# EAGLE board keyboard_schematic (EAGLE 9.6.1)
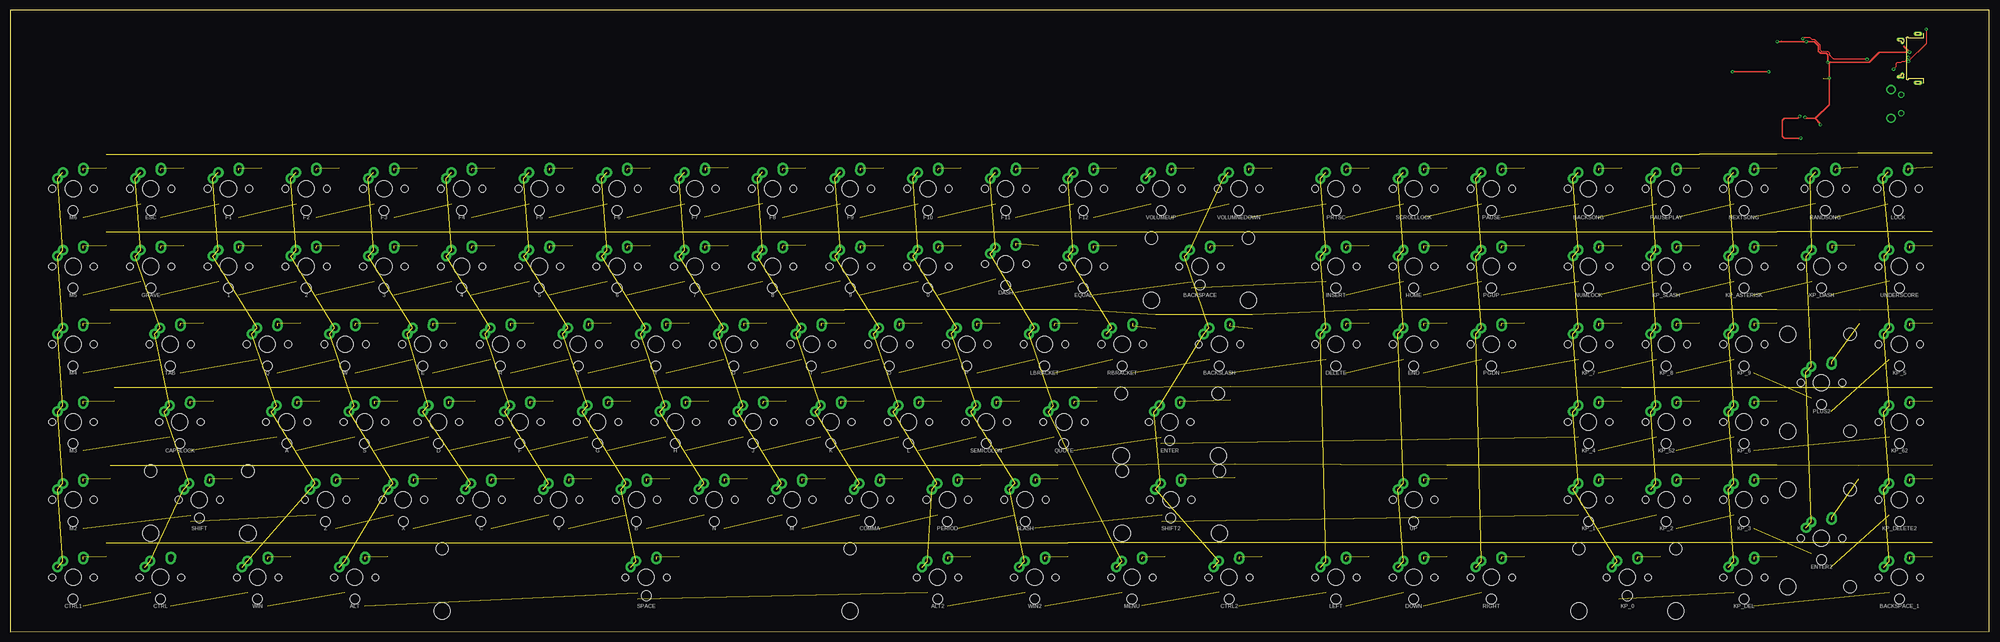
[diagram p6: board, top side]
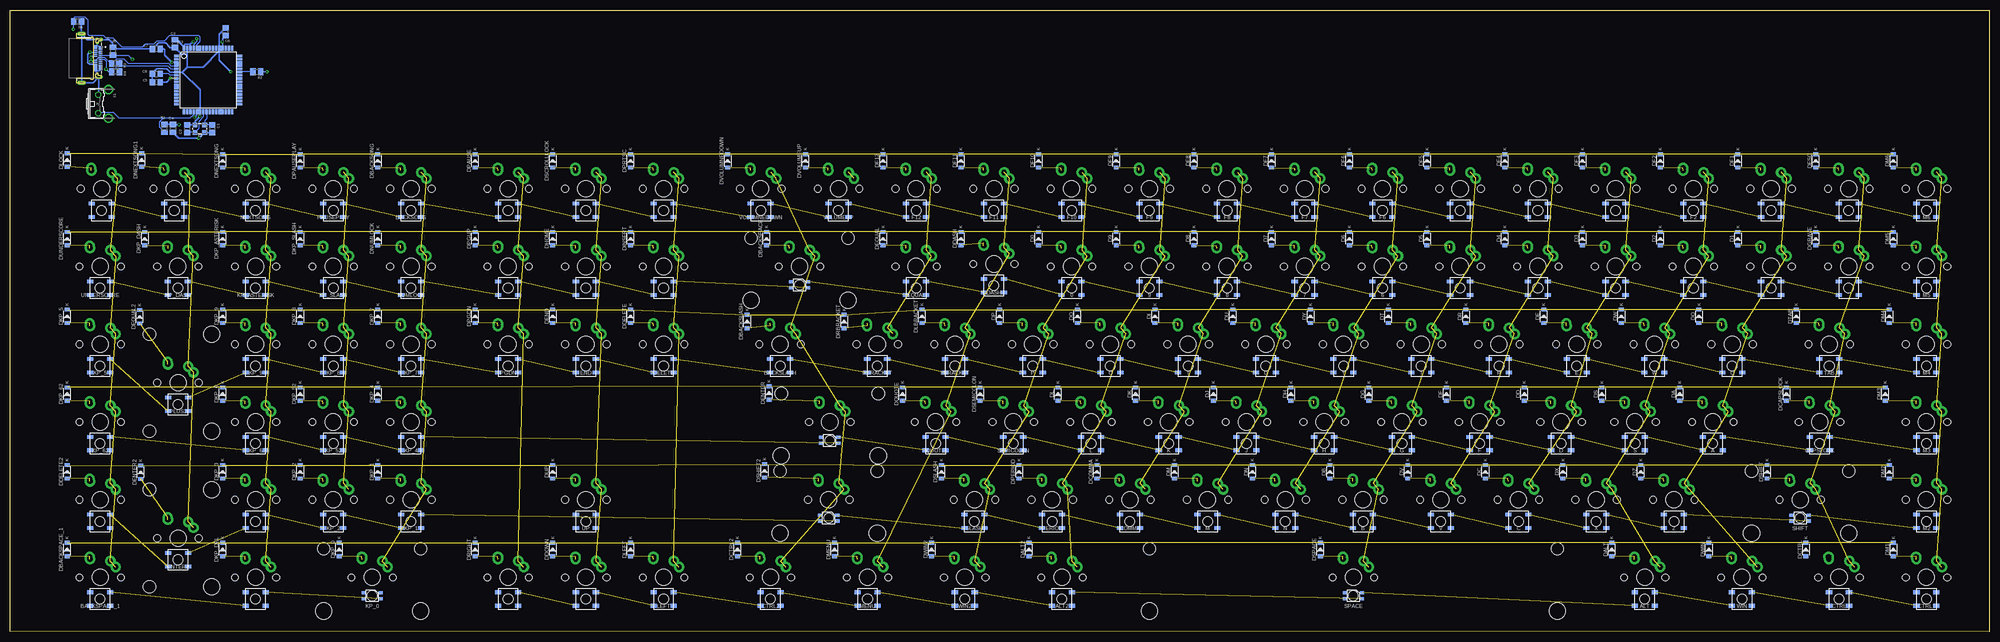
[diagram p7: board, bottom side, seen from below]

Size 485.13 x 152.29 mm. Coordinates in mm from the lower left corner, seen from the top.
Outline: 0.05,0 485.13,0.06 485.08,152.29 0,152.23 0.05,0
Copper layers (1*16): Top 0.035mm / dielectric 1.5mm / Bottom 0.035mm
Design rules "default *": minimum track width 6mil, minimum drill 0.35mm, track to track 6mil, track to pad 6mil, pad to pad 6mil, via to via 6mil, smd to smd 6mil, copper to edge 40mil, drill to drill 6mil, minimum pad ring 10mil, minimum via ring 8mil, stop-mask expansion 4mil, vias tented up to drill 0mil, thermal gap 10mil

## Footprints (pad centres in the part's own frame; a part is rotated, then mirrored left to right if it is on the bottom)
ALPSMX-1U-SMDRGB = drill 1.3 pad 2.54: ALPS1 -2.5,4; ALPS2 2.5,4.5; MX1 -3.81,2.54; MX2 2.54,5.08 | smd 1.5 x 0.9 bottom: DIN -2.45,-3.65; DOUT 2.45,-6.95; VDD 2.45,-3.65; VSS -2.45,-6.95 | hole 4: 0,0 | hole 1.7: -5.08,0; 5.08,0 | hole 2.4: 0,-5.3
ALPSMX-2U-SMDRGB = drill 1.3 pad 2.54: ALPS1 -2.5,4; ALPS2 2.5,4.5; MX1 -3.81,2.54; MX2 2.54,5.08 | smd 1 x 0.75 bottom: B- 2.1,-5.225; G- -2.1,-5.225; LED+ 2.1,-3.775; R- -2.1,-3.775 | hole 4: 0,0; -11.9,-8.24; 11.9,-8.24 | hole 1.7: -5.08,0; 5.08,0 | hole 2.4: 0,-4.5 | hole 3.05: -11.9,7; 11.9,7
C0805 = smd 1.3 x 1.5: 1 -0.95,0; 2 0.95,0
SOD-123 = smd 0.91 x 1.22: A -1.635,0; C 1.635,0
ALPSMX-2U-SMDRGB-ROTATED = drill 1.3 pad 2.54: ALPS1 -2.5,4; ALPS2 2.5,4.5; MX1 -3.81,2.54; MX2 2.54,5.08 | smd 1.5 x 0.9 bottom: DIN -2.45,-3.65; DOUT 2.45,-6.95; VDD 2.45,-3.65; VSS -2.45,-6.95 | hole 4: 0,0; -8.24,-11.9; -8.24,11.9 | hole 1.7: -5.08,0; 5.08,0 | hole 3.05: 7,-11.9; 7,11.9 | hole 2.4: 0,-5.3
TQFP64 = smd 1.194 x 0.559: 1 -7.76,5.905; 2 -7.76,5.118; 3 -7.76,4.331; 4 -7.76,3.543; 5 -7.76,2.756; 6 -7.76,1.968; 7 -7.76,1.181; 8 -7.76,0.394; 9 -7.76,-0.394; 10 -7.76,-1.181; 11 -7.76,-1.968; 12 -7.76,-2.756; 13 -7.76,-3.543; 14 -7.76,-4.331; 15 -7.76,-5.118; 16 -7.76,-5.905; 33 7.76,-5.905; 34 7.76,-5.118; 35 7.76,-4.331; 36 7.76,-3.543; 37 7.76,-2.756; 38 7.76,-1.968; 39 7.76,-1.181; 40 7.76,-0.394; 41 7.76,0.394; 42 7.76,1.181; 43 7.76,1.968; 44 7.76,2.756; 45 7.76,3.543; 46 7.76,4.331; 47 7.76,5.118; 48 7.76,5.905 | smd 0.559 x 1.194: 17 -5.905,-7.76; 18 -5.118,-7.76; 19 -4.331,-7.76; 20 -3.543,-7.76; 21 -2.756,-7.76; 22 -1.968,-7.76; 23 -1.181,-7.76; 24 -0.394,-7.76; 25 0.394,-7.76; 26 1.181,-7.76; 27 1.968,-7.76; 28 2.756,-7.76; 29 3.543,-7.76; 30 4.331,-7.76; 31 5.118,-7.76; 32 5.905,-7.76; 49 5.905,7.76; 50 5.118,7.76; 51 4.331,7.76; 52 3.543,7.76; 53 2.756,7.76; 54 1.968,7.76; 55 1.181,7.76; 56 0.394,7.76; 57 -0.394,7.76; 58 -1.181,7.76; 59 -1.968,7.76; 60 -2.756,7.76; 61 -3.543,7.76; 62 -4.331,7.76; 63 -5.118,7.76; 64 -5.905,7.76
TE_1-2295018-2 = smd 0.3 x 0.8: A1 -2.75,4.63; A2 -2.25,4.63; A3 -1.75,4.63; A4 -1.25,4.63; A5 -0.75,4.63; A6 -0.25,4.63; A7 0.25,4.63; A8 0.75,4.63; A9 1.25,4.63; A10 1.75,4.63; A11 2.25,4.63; A12 2.75,4.63; B1 3,3.43; B2 2.5,3.43; B3 2,3.43; B4 1.5,3.43; B5 1,3.43; B6 0.5,3.43; B7 -0.5,3.43; B8 -1,3.43; B9 -1.5,3.43; B10 -2,3.43; B11 -2.5,3.43; B12 -3,3.43 | drill 0.5 long: P1_1 -4.55,4.22; P2_1 4.55,4.22 | drill 0.35 long: P1_2 -4.191,3.795; P2_2 4.191,3.795 | drill 0.5 pad 1.1 long: P4 -5.97,0; P5 5.97,0
M0805 = smd 1.3 x 1.6: 1 -0.95,0; 2 0.95,0
B3F-31XX = drill 1.016 octagon: 1 -2.261,-1.245; 2 2.261,-1.245 | drill 1.499 pad 2.159: 3 -3.505,1.245; 4 3.505,1.245
ALPSMX-6.25U-SMDRGB = drill 1.3 pad 2.54: ALPS1 -2.5,4; ALPS2 2.5,4.5; MX1 -3.81,2.54; MX2 2.54,5.08 | smd 1 x 0.75 bottom: B- 2.1,-5.225; G- -2.1,-5.225; LED+ 2.1,-3.775; R- -2.1,-3.775 | hole 4: 0,0; -50,-8.24; 50,-8.24 | hole 1.7: -5.08,0; 5.08,0 | hole 2.4: 0,-4.5 | hole 3.05: -50,7; 50,7
CRYSTAL-SMD-3.2X2.5MM = smd 1.2 x 1.1: 1 -1.175,-0.875; 2 1.175,-0.875; 3 1.175,0.875; 4 -1.175,0.875

## Placement (x,y rotation side)
0  KEYSWITCH-RGBSMDLED-ALPSMX-1U-SMDRGB  [ALPSMX-1U-SMDRGB]  224.95,89.49 0 top
1  KEYSWITCH-RGBSMDLED-ALPSMX-1U-SMDRGB  [ALPSMX-1U-SMDRGB]  53.5,89.49 0 top
2  KEYSWITCH-RGBSMDLED-ALPSMX-1U-SMDRGB  [ALPSMX-1U-SMDRGB]  72.55,89.49 0 top
3  KEYSWITCH-RGBSMDLED-ALPSMX-1U-SMDRGB  [ALPSMX-1U-SMDRGB]  91.6,89.49 0 top
4  KEYSWITCH-RGBSMDLED-ALPSMX-1U-SMDRGB  [ALPSMX-1U-SMDRGB]  110.65,89.49 0 top
5  KEYSWITCH-RGBSMDLED-ALPSMX-1U-SMDRGB  [ALPSMX-1U-SMDRGB]  129.7,89.49 0 top
6  KEYSWITCH-RGBSMDLED-ALPSMX-1U-SMDRGB  [ALPSMX-1U-SMDRGB]  148.75,89.49 0 top
7  KEYSWITCH-RGBSMDLED-ALPSMX-1U-SMDRGB  [ALPSMX-1U-SMDRGB]  167.8,89.49 0 top
8  KEYSWITCH-RGBSMDLED-ALPSMX-1U-SMDRGB  [ALPSMX-1U-SMDRGB]  186.85,89.49 0 top
9  KEYSWITCH-RGBSMDLED-ALPSMX-1U-SMDRGB  [ALPSMX-1U-SMDRGB]  205.9,89.49 0 top
A  KEYSWITCH-RGBSMDLED-ALPSMX-1U-SMDRGB  [ALPSMX-1U-SMDRGB]  67.79,51.39 0 top
ALT  KEYSWITCH-RGBSMDLED-ALPSMX-1U-SMDRGB  [ALPSMX-1U-SMDRGB]  84.46,13.29 0 top
ALT2  KEYSWITCH-RGBSMDLED-ALPSMX-1U-SMDRGB  [ALPSMX-1U-SMDRGB]  227.33,13.29 0 top
B  KEYSWITCH-RGBSMDLED-ALPSMX-1U-SMDRGB  [ALPSMX-1U-SMDRGB]  153.51,32.34 0 top
BACKSLASH  KEYSWITCH-RGBSMDLED-ALPSMX-1U-SMDRGB  [ALPSMX-1U-SMDRGB]  296.39,70.44 0 top
BACKSONG  KEYSWITCH-RGBSMDLED-ALPSMX-1U-SMDRGB  [ALPSMX-1U-SMDRGB]  386.88,108.54 0 top
BACKSPACE  KEYSWITCH-RGBSMDLED-ALPSMX-2U-SMDRGB  [ALPSMX-2U-SMDRGB]  291.63,89.49 0 top
BACKSPACE_1  KEYSWITCH-RGBSMDLED-ALPSMX-1U-SMDRGB  [ALPSMX-1U-SMDRGB]  463.08,13.29 0 top
C  KEYSWITCH-RGBSMDLED-ALPSMX-1U-SMDRGB  [ALPSMX-1U-SMDRGB]  115.41,32.34 0 top
C1  22pF  [C0805]  435.6,123.24 270 bottom
C2  22pF  [C0805]  441.7,123.24 90 bottom
C3  0.1uF  [C0805]  444.75,144.09 270 bottom
C4  0.1uF  [C0805]  445.23,123.34 270 bottom
C5  0.1uF  [C0805]  449.32,134.64 180 bottom
C6  0.1uF  [C0805]  432.33,147.01 90 bottom
C7  0.1uF  [C0805]  449.32,142.8 180 bottom
C8  1u  [C0805]  449.32,136.7 0 bottom
CAPSLOCK  KEYSWITCH-RGBSMDLED-ALPSMX-1U-SMDRGB  [ALPSMX-1U-SMDRGB]  41.59,51.39 0 top
COMMA  KEYSWITCH-RGBSMDLED-ALPSMX-1U-SMDRGB  [ALPSMX-1U-SMDRGB]  210.66,32.34 0 top
CTRL  KEYSWITCH-RGBSMDLED-ALPSMX-1U-SMDRGB  [ALPSMX-1U-SMDRGB]  36.83,13.29 0 top
CTRL1  KEYSWITCH-RGBSMDLED-ALPSMX-1U-SMDRGB  [ALPSMX-1U-SMDRGB]  15.4,13.29 0 top
CTRL2  KEYSWITCH-RGBSMDLED-ALPSMX-1U-SMDRGB  [ALPSMX-1U-SMDRGB]  298.77,13.29 0 top
D  KEYSWITCH-RGBSMDLED-ALPSMX-1U-SMDRGB  [ALPSMX-1U-SMDRGB]  104.97,51.39 0 top
D0  [SOD-123]  233.06,96.33 90 bottom
D1  [SOD-123]  61.61,96.33 90 bottom
D2  [SOD-123]  80.66,96.33 90 bottom
D3  [SOD-123]  99.71,96.33 90 bottom
D4  [SOD-123]  118.76,96.33 90 bottom
D5  [SOD-123]  137.81,96.33 90 bottom
D6  [SOD-123]  156.86,96.33 90 bottom
D7  [SOD-123]  175.91,96.33 90 bottom
D8  [SOD-123]  194.96,96.33 90 bottom
D9  [SOD-123]  214.01,96.33 90 bottom
DA  [SOD-123]  75.9,58.23 90 bottom
DALT  [SOD-123]  92.57,20.13 90 bottom
DALT2  [SOD-123]  235.44,20.13 90 bottom
DASH  KEYSWITCH-RGBSMDLED-ALPSMX-1U-SMDRGB  [ALPSMX-1U-SMDRGB]  244,90.09 0 top
DB  [SOD-123]  161.62,39.18 90 bottom
DBACKSLASH  [SOD-123]  304.5,76.01 90 bottom
DBACKSONG  [SOD-123]  394.99,115.38 90 bottom
DBACKSPACE  [SOD-123]  299.74,96.33 90 bottom
DBACKSPACE_1  [SOD-123]  471.19,20.13 90 bottom
DC  [SOD-123]  123.52,39.18 90 bottom
DCAPSLOCK  [SOD-123]  49.7,58.23 90 bottom
DCOMMA  [SOD-123]  218.77,39.18 90 bottom
DCTRL  [SOD-123]  44.94,20.13 90 bottom
DCTRL2  [SOD-123]  306.88,20.13 90 bottom
DD  [SOD-123]  114,58.23 90 bottom
DDASH  [SOD-123]  252.11,96.33 90 bottom
DDELETE  [SOD-123]  333.07,77.28 90 bottom
DDELETE2  [SOD-123]  471.19,39.18 90 bottom
DDOWN  [SOD-123]  352.12,20.13 90 bottom
DE  [SOD-123]  109.24,77.28 90 bottom
DELETE  KEYSWITCH-RGBSMDLED-ALPSMX-1U-SMDRGB  [ALPSMX-1U-SMDRGB]  324.96,70.44 0 top
DEND  [SOD-123]  352.12,77.28 90 bottom
DENTER  [SOD-123]  299.13,58.48 90 bottom
DENTER2  [SOD-123]  453.16,39.06 90 bottom
DEQUAL  [SOD-123]  271.16,96.33 90 bottom
DEQUAL2  [SOD-123]  453.41,77.16 90 bottom
DESC  [SOD-123]  42.56,115.38 90 bottom
DF  [SOD-123]  133.05,58.23 90 bottom
DF1  [SOD-123]  61.61,115.38 90 bottom
DF2  [SOD-123]  80.66,115.38 90 bottom
DF3  [SOD-123]  99.71,115.38 90 bottom
DF4  [SOD-123]  118.76,115.38 90 bottom
DF5  [SOD-123]  137.81,115.38 90 bottom
DF6  [SOD-123]  156.86,115.38 90 bottom
DF7  [SOD-123]  175.91,115.38 90 bottom
DF8  [SOD-123]  194.96,115.38 90 bottom
DF9  [SOD-123]  214.01,115.38 90 bottom
DF10  [SOD-123]  233.06,115.38 90 bottom
DF11  [SOD-123]  252.11,115.38 90 bottom
DF12  [SOD-123]  271.16,115.38 90 bottom
DG  [SOD-123]  152.1,58.23 90 bottom
DGRAVE  [SOD-123]  42.56,96.33 90 bottom
DH  [SOD-123]  171.15,58.23 90 bottom
DHOME  [SOD-123]  352.12,96.33 90 bottom
DI  [SOD-123]  204.49,77.28 90 bottom
DINSERT  [SOD-123]  333.07,96.33 90 bottom
DJ  [SOD-123]  190.2,58.23 90 bottom
DK  [SOD-123]  209.25,58.23 90 bottom
DKP_0  [SOD-123]  404.51,20.13 90 bottom
DKP_1  [SOD-123]  394.99,39.18 90 bottom
DKP_2  [SOD-123]  414.04,39.18 90 bottom
DKP_3  [SOD-123]  433.09,39.18 90 bottom
DKP_4  [SOD-123]  394.99,58.23 90 bottom
DKP_5  [SOD-123]  471.19,77.28 90 bottom
DKP_6  [SOD-123]  433.09,58.23 90 bottom
DKP_7  [SOD-123]  394.99,77.28 90 bottom
DKP_8  [SOD-123]  414.04,77.28 90 bottom
DKP_9  [SOD-123]  433.09,77.28 90 bottom
DKP_52  [SOD-123]  414.04,58.23 90 bottom
DKP_62  [SOD-123]  471.19,58.23 90 bottom
DKP_ASTERISK  [SOD-123]  433.09,96.33 90 bottom
DKP_DASH  [SOD-123]  452.14,96.33 90 bottom
DKP_DEL  [SOD-123]  433.09,20.13 90 bottom
DKP_SLASH  [SOD-123]  414.04,96.33 90 bottom
DL  [SOD-123]  228.3,58.23 90 bottom
DLBRACKET  [SOD-123]  261.64,77.28 90 bottom
DLEFT  [SOD-123]  333.07,20.13 90 bottom
DLOCK  [SOD-123]  471.19,115.59 90 bottom
DM  [SOD-123]  199.72,39.18 90 bottom
DM1  [SOD-123]  23.51,20.13 90 bottom
DM2  [SOD-123]  24.51,39.18 90 bottom
DM3  [SOD-123]  25.51,58.23 90 bottom
DM4  [SOD-123]  24.51,77.28 90 bottom
DM5  [SOD-123]  23.51,96.33 90 bottom
DM6  [SOD-123]  23.51,115.38 90 bottom
DMENU  [SOD-123]  283.07,20.13 90 bottom
DN  [SOD-123]  180.67,39.18 90 bottom
DNEXTSONG  [SOD-123]  433.09,115.38 90 bottom
DNEXTSONG1  [SOD-123]  452.93,115.59 90 bottom
DNUMLOCK  [SOD-123]  394.99,96.33 90 bottom
DO  [SOD-123]  223.54,77.28 90 bottom
DOWN  KEYSWITCH-RGBSMDLED-ALPSMX-1U-SMDRGB  [ALPSMX-1U-SMDRGB]  344.01,13.29 0 top
DP  [SOD-123]  242.59,77.28 90 bottom
DPAUSE  [SOD-123]  371.17,115.38 90 bottom
DPAUSEPLAY  [SOD-123]  414.04,115.38 90 bottom
DPERIOD  [SOD-123]  237.82,39.18 90 bottom
DPGDN  [SOD-123]  371.17,77.28 90 bottom
DPGUP  [SOD-123]  371.17,96.33 90 bottom
DPRTSC  [SOD-123]  333.07,115.38 90 bottom
DQ  [SOD-123]  71.14,77.28 90 bottom
DQUOTE  [SOD-123]  266.4,58.23 90 bottom
DR  [SOD-123]  128.29,77.28 90 bottom
DRBRACKET  [SOD-123]  280.69,76.01 90 bottom
DRIGHT  [SOD-123]  371.17,20.13 90 bottom
DS  [SOD-123]  94.95,58.23 90 bottom
DSCROLLLOCK  [SOD-123]  352.12,115.38 90 bottom
DSEMICOLON  [SOD-123]  247.35,58.23 90 bottom
DSHIFT  [SOD-123]  54.47,39.18 90 bottom
DSHIFT2  [SOD-123]  300.21,39.43 90 bottom
DSLASH  [SOD-123]  256.87,39.18 90 bottom
DSPACE  [SOD-123]  164,20.13 90 bottom
DT  [SOD-123]  147.34,77.28 90 bottom
DTAB  [SOD-123]  47.32,77.28 90 bottom
DU  [SOD-123]  185.44,77.28 90 bottom
DUNDERSCORE  [SOD-123]  471.19,96.33 90 bottom
DUP  [SOD-123]  352.12,39.18 90 bottom
DV  [SOD-123]  142.57,39.18 90 bottom
DVOLUMEUP  [SOD-123]  290.21,115.38 90 bottom
DVOLUMNEDOWN  [SOD-123]  309.26,115.38 90 bottom
DW  [SOD-123]  90.19,77.28 90 bottom
DWIN  [SOD-123]  68.75,20.13 90 bottom
DWIN2  [SOD-123]  259.25,20.13 90 bottom
DX  [SOD-123]  104.47,39.18 90 bottom
DY  [SOD-123]  166.39,77.28 90 bottom
DZ  [SOD-123]  85.42,39.18 90 bottom
E  KEYSWITCH-RGBSMDLED-ALPSMX-1U-SMDRGB  [ALPSMX-1U-SMDRGB]  101.13,70.44 0 top
END  KEYSWITCH-RGBSMDLED-ALPSMX-1U-SMDRGB  [ALPSMX-1U-SMDRGB]  344.01,70.44 0 top
ENTER  KEYSWITCH-RGBSMDLED-ALPSMX-2U-SMDRGB  [ALPSMX-2U-SMDRGB]  284.23,51.39 0 top
ENTER2  KEYSWITCH-RGBSMDLED-ALPSMX-2U-SMDRGB-ROTATED  [ALPSMX-2U-SMDRGB-ROTATED]  443.99,22.91 0 top
EQUAL  KEYSWITCH-RGBSMDLED-ALPSMX-1U-SMDRGB  [ALPSMX-1U-SMDRGB]  263.05,89.49 0 top
ESC  KEYSWITCH-RGBSMDLED-ALPSMX-1U-SMDRGB  [ALPSMX-1U-SMDRGB]  34.45,108.54 0 top
F  KEYSWITCH-RGBSMDLED-ALPSMX-1U-SMDRGB  [ALPSMX-1U-SMDRGB]  124.94,51.39 0 top
F1  KEYSWITCH-RGBSMDLED-ALPSMX-1U-SMDRGB  [ALPSMX-1U-SMDRGB]  53.5,108.54 0 top
F2  KEYSWITCH-RGBSMDLED-ALPSMX-1U-SMDRGB  [ALPSMX-1U-SMDRGB]  72.55,108.54 0 top
F3  KEYSWITCH-RGBSMDLED-ALPSMX-1U-SMDRGB  [ALPSMX-1U-SMDRGB]  91.6,108.54 0 top
F4  KEYSWITCH-RGBSMDLED-ALPSMX-1U-SMDRGB  [ALPSMX-1U-SMDRGB]  110.65,108.54 0 top
F5  KEYSWITCH-RGBSMDLED-ALPSMX-1U-SMDRGB  [ALPSMX-1U-SMDRGB]  129.7,108.54 0 top
F6  KEYSWITCH-RGBSMDLED-ALPSMX-1U-SMDRGB  [ALPSMX-1U-SMDRGB]  148.75,108.54 0 top
F7  KEYSWITCH-RGBSMDLED-ALPSMX-1U-SMDRGB  [ALPSMX-1U-SMDRGB]  167.8,108.54 0 top
F8  KEYSWITCH-RGBSMDLED-ALPSMX-1U-SMDRGB  [ALPSMX-1U-SMDRGB]  186.85,108.54 0 top
F9  KEYSWITCH-RGBSMDLED-ALPSMX-1U-SMDRGB  [ALPSMX-1U-SMDRGB]  205.9,108.54 0 top
F10  KEYSWITCH-RGBSMDLED-ALPSMX-1U-SMDRGB  [ALPSMX-1U-SMDRGB]  224.95,108.54 0 top
F11  KEYSWITCH-RGBSMDLED-ALPSMX-1U-SMDRGB  [ALPSMX-1U-SMDRGB]  244,108.54 0 top
F12  KEYSWITCH-RGBSMDLED-ALPSMX-1U-SMDRGB  [ALPSMX-1U-SMDRGB]  263.05,108.54 0 top
G  KEYSWITCH-RGBSMDLED-ALPSMX-1U-SMDRGB  [ALPSMX-1U-SMDRGB]  143.99,51.39 0 top
GRAVE  KEYSWITCH-RGBSMDLED-ALPSMX-1U-SMDRGB  [ALPSMX-1U-SMDRGB]  34.45,89.49 0 top
H  KEYSWITCH-RGBSMDLED-ALPSMX-1U-SMDRGB  [ALPSMX-1U-SMDRGB]  163.04,51.39 0 top
HOME  KEYSWITCH-RGBSMDLED-ALPSMX-1U-SMDRGB  [ALPSMX-1U-SMDRGB]  344.01,89.49 0 top
I  KEYSWITCH-RGBSMDLED-ALPSMX-1U-SMDRGB  [ALPSMX-1U-SMDRGB]  196.38,70.44 0 top
IC3  [TQFP64]  436.62,135.18 0 bottom
INSERT  KEYSWITCH-RGBSMDLED-ALPSMX-1U-SMDRGB  [ALPSMX-1U-SMDRGB]  324.96,89.49 0 top
J  KEYSWITCH-RGBSMDLED-ALPSMX-1U-SMDRGB  [ALPSMX-1U-SMDRGB]  182.09,51.39 0 top
J1  1-2295018-2  [TE_1-2295018-2]  467.61,140.51 270 bottom
K  KEYSWITCH-RGBSMDLED-ALPSMX-1U-SMDRGB  [ALPSMX-1U-SMDRGB]  201.14,51.39 0 top
KP_0  KEYSWITCH-RGBSMDLED-ALPSMX-2U-SMDRGB  [ALPSMX-2U-SMDRGB]  396.4,13.29 0 top
KP_1  KEYSWITCH-RGBSMDLED-ALPSMX-1U-SMDRGB  [ALPSMX-1U-SMDRGB]  386.88,32.34 0 top
KP_2  KEYSWITCH-RGBSMDLED-ALPSMX-1U-SMDRGB  [ALPSMX-1U-SMDRGB]  405.93,32.34 0 top
KP_3  KEYSWITCH-RGBSMDLED-ALPSMX-1U-SMDRGB  [ALPSMX-1U-SMDRGB]  424.98,32.34 0 top
KP_4  KEYSWITCH-RGBSMDLED-ALPSMX-1U-SMDRGB  [ALPSMX-1U-SMDRGB]  386.88,51.39 0 top
KP_5  KEYSWITCH-RGBSMDLED-ALPSMX-1U-SMDRGB  [ALPSMX-1U-SMDRGB]  463.08,70.44 0 top
KP_6  KEYSWITCH-RGBSMDLED-ALPSMX-1U-SMDRGB  [ALPSMX-1U-SMDRGB]  424.98,51.39 0 top
KP_7  KEYSWITCH-RGBSMDLED-ALPSMX-1U-SMDRGB  [ALPSMX-1U-SMDRGB]  386.88,70.44 0 top
KP_8  KEYSWITCH-RGBSMDLED-ALPSMX-1U-SMDRGB  [ALPSMX-1U-SMDRGB]  405.93,70.44 0 top
KP_9  KEYSWITCH-RGBSMDLED-ALPSMX-1U-SMDRGB  [ALPSMX-1U-SMDRGB]  424.98,70.44 0 top
KP_52  KEYSWITCH-RGBSMDLED-ALPSMX-1U-SMDRGB  [ALPSMX-1U-SMDRGB]  405.93,51.39 0 top
KP_62  KEYSWITCH-RGBSMDLED-ALPSMX-1U-SMDRGB  [ALPSMX-1U-SMDRGB]  463.08,51.39 0 top
KP_ASTERISK  KEYSWITCH-RGBSMDLED-ALPSMX-1U-SMDRGB  [ALPSMX-1U-SMDRGB]  424.98,89.49 0 top
KP_DASH  KEYSWITCH-RGBSMDLED-ALPSMX-1U-SMDRGB  [ALPSMX-1U-SMDRGB]  444.03,89.49 0 top
KP_DEL  KEYSWITCH-RGBSMDLED-ALPSMX-1U-SMDRGB  [ALPSMX-1U-SMDRGB]  424.98,13.29 0 top
KP_DELETE2  KEYSWITCH-RGBSMDLED-ALPSMX-1U-SMDRGB  [ALPSMX-1U-SMDRGB]  463.08,32.34 0 top
KP_SLASH  KEYSWITCH-RGBSMDLED-ALPSMX-1U-SMDRGB  [ALPSMX-1U-SMDRGB]  405.93,89.49 0 top
L  KEYSWITCH-RGBSMDLED-ALPSMX-1U-SMDRGB  [ALPSMX-1U-SMDRGB]  220.19,51.39 0 top
LBRACKET  KEYSWITCH-RGBSMDLED-ALPSMX-1U-SMDRGB  [ALPSMX-1U-SMDRGB]  253.53,70.44 0 top
LEFT  KEYSWITCH-RGBSMDLED-ALPSMX-1U-SMDRGB  [ALPSMX-1U-SMDRGB]  324.96,13.29 0 top
LOCK  KEYSWITCH-RGBSMDLED-ALPSMX-1U-SMDRGB  [ALPSMX-1U-SMDRGB]  462.73,108.54 0 top
M  KEYSWITCH-RGBSMDLED-ALPSMX-1U-SMDRGB  [ALPSMX-1U-SMDRGB]  191.61,32.34 0 top
M2  KEYSWITCH-RGBSMDLED-ALPSMX-1U-SMDRGB  [ALPSMX-1U-SMDRGB]  15.4,32.34 0 top
M3  KEYSWITCH-RGBSMDLED-ALPSMX-1U-SMDRGB  [ALPSMX-1U-SMDRGB]  15.4,51.39 0 top
M4  KEYSWITCH-RGBSMDLED-ALPSMX-1U-SMDRGB  [ALPSMX-1U-SMDRGB]  15.4,70.44 0 top
M5  KEYSWITCH-RGBSMDLED-ALPSMX-1U-SMDRGB  [ALPSMX-1U-SMDRGB]  15.4,89.49 0 top
M6  KEYSWITCH-RGBSMDLED-ALPSMX-1U-SMDRGB  [ALPSMX-1U-SMDRGB]  15.4,108.54 0 top
MENU  KEYSWITCH-RGBSMDLED-ALPSMX-1U-SMDRGB  [ALPSMX-1U-SMDRGB]  274.96,13.29 0 top
N  KEYSWITCH-RGBSMDLED-ALPSMX-1U-SMDRGB  [ALPSMX-1U-SMDRGB]  172.56,32.34 0 top
NEXTSONG  KEYSWITCH-RGBSMDLED-ALPSMX-1U-SMDRGB  [ALPSMX-1U-SMDRGB]  424.98,108.54 0 top
NUMLOCK  KEYSWITCH-RGBSMDLED-ALPSMX-1U-SMDRGB  [ALPSMX-1U-SMDRGB]  386.88,89.49 0 top
O  KEYSWITCH-RGBSMDLED-ALPSMX-1U-SMDRGB  [ALPSMX-1U-SMDRGB]  215.43,70.44 0 top
P  KEYSWITCH-RGBSMDLED-ALPSMX-1U-SMDRGB  [ALPSMX-1U-SMDRGB]  234.48,70.44 0 top
PAUSE  KEYSWITCH-RGBSMDLED-ALPSMX-1U-SMDRGB  [ALPSMX-1U-SMDRGB]  363.06,108.54 0 top
PAUSEPLAY  KEYSWITCH-RGBSMDLED-ALPSMX-1U-SMDRGB  [ALPSMX-1U-SMDRGB]  405.93,108.54 0 top
PERIOD  KEYSWITCH-RGBSMDLED-ALPSMX-1U-SMDRGB  [ALPSMX-1U-SMDRGB]  229.71,32.34 0 top
PGDN  KEYSWITCH-RGBSMDLED-ALPSMX-1U-SMDRGB  [ALPSMX-1U-SMDRGB]  363.06,70.44 0 top
PGUP  KEYSWITCH-RGBSMDLED-ALPSMX-1U-SMDRGB  [ALPSMX-1U-SMDRGB]  363.06,89.49 0 top
PLUS2  KEYSWITCH-RGBSMDLED-ALPSMX-2U-SMDRGB-ROTATED  [ALPSMX-2U-SMDRGB-ROTATED]  443.99,61.01 0 top
PRTSC  KEYSWITCH-RGBSMDLED-ALPSMX-1U-SMDRGB  [ALPSMX-1U-SMDRGB]  324.96,108.54 0 top
Q  KEYSWITCH-RGBSMDLED-ALPSMX-1U-SMDRGB  [ALPSMX-1U-SMDRGB]  63.03,70.44 0 top
QUOTE  KEYSWITCH-RGBSMDLED-ALPSMX-1U-SMDRGB  [ALPSMX-1U-SMDRGB]  258.29,51.39 0 top
R  KEYSWITCH-RGBSMDLED-ALPSMX-1U-SMDRGB  [ALPSMX-1U-SMDRGB]  120.18,70.44 0 top
R1  10k  [M0805]  447.26,123.34 270 bottom
R2  10k  [M0805]  424.68,137.21 180 bottom
R3  22  [M0805]  459.28,139.24 0 bottom
R4  22  [M0805]  459.28,137.21 0 bottom
R5  5.1k  [M0805]  459.96,142.26 90 bottom
R6  5.1k  [M0805]  468.62,149.55 180 bottom
RANDSONG  KEYSWITCH-RGBSMDLED-ALPSMX-1U-SMDRGB  [ALPSMX-1U-SMDRGB]  444.93,108.54 0 top
RBRACKET  KEYSWITCH-RGBSMDLED-ALPSMX-1U-SMDRGB  [ALPSMX-1U-SMDRGB]  272.58,70.44 0 top
RIGHT  KEYSWITCH-RGBSMDLED-ALPSMX-1U-SMDRGB  [ALPSMX-1U-SMDRGB]  363.06,13.29 0 top
S  KEYSWITCH-RGBSMDLED-ALPSMX-1U-SMDRGB  [ALPSMX-1U-SMDRGB]  86.84,51.39 0 top
S1  [B3F-31XX]  462.27,129.34 270 bottom
SCROLLLOCK  KEYSWITCH-RGBSMDLED-ALPSMX-1U-SMDRGB  [ALPSMX-1U-SMDRGB]  344.01,108.54 0 top
SEMICOLON  KEYSWITCH-RGBSMDLED-ALPSMX-1U-SMDRGB  [ALPSMX-1U-SMDRGB]  239.24,51.39 0 top
SHIFT  KEYSWITCH-RGBSMDLED-ALPSMX-2U-SMDRGB  [ALPSMX-2U-SMDRGB]  46.36,32.34 0 top
SHIFT2  KEYSWITCH-RGBSMDLED-ALPSMX-2U-SMDRGB  [ALPSMX-2U-SMDRGB]  284.48,32.34 0 top
SLASH  KEYSWITCH-RGBSMDLED-ALPSMX-1U-SMDRGB  [ALPSMX-1U-SMDRGB]  248.76,32.34 0 top
SPACE  KEYSWITCH-RGBSMDLED-ALPSMX-6.25U-SMDRGB  [ALPSMX-6.25U-SMDRGB]  155.89,13.29 0 top
T  KEYSWITCH-RGBSMDLED-ALPSMX-1U-SMDRGB  [ALPSMX-1U-SMDRGB]  139.23,70.44 0 top
TAB  KEYSWITCH-RGBSMDLED-ALPSMX-1U-SMDRGB  [ALPSMX-1U-SMDRGB]  39.21,70.44 0 top
U  KEYSWITCH-RGBSMDLED-ALPSMX-1U-SMDRGB  [ALPSMX-1U-SMDRGB]  177.33,70.44 0 top
UNDERSCORE  KEYSWITCH-RGBSMDLED-ALPSMX-1U-SMDRGB  [ALPSMX-1U-SMDRGB]  463.08,89.49 0 top
UP  KEYSWITCH-RGBSMDLED-ALPSMX-1U-SMDRGB  [ALPSMX-1U-SMDRGB]  344.01,32.34 0 top
V  KEYSWITCH-RGBSMDLED-ALPSMX-1U-SMDRGB  [ALPSMX-1U-SMDRGB]  134.46,32.34 0 top
VOLUMEUP  KEYSWITCH-RGBSMDLED-ALPSMX-1U-SMDRGB  [ALPSMX-1U-SMDRGB]  282.1,108.54 0 top
VOLUMNEDOWN  KEYSWITCH-RGBSMDLED-ALPSMX-1U-SMDRGB  [ALPSMX-1U-SMDRGB]  301.15,108.54 0 top
W  KEYSWITCH-RGBSMDLED-ALPSMX-1U-SMDRGB  [ALPSMX-1U-SMDRGB]  82.08,70.44 0 top
WIN  KEYSWITCH-RGBSMDLED-ALPSMX-1U-SMDRGB  [ALPSMX-1U-SMDRGB]  60.64,13.29 0 top
WIN2  KEYSWITCH-RGBSMDLED-ALPSMX-1U-SMDRGB  [ALPSMX-1U-SMDRGB]  251.14,13.29 0 top
X  KEYSWITCH-RGBSMDLED-ALPSMX-1U-SMDRGB  [ALPSMX-1U-SMDRGB]  96.36,32.34 0 top
Y  KEYSWITCH-RGBSMDLED-ALPSMX-1U-SMDRGB  [ALPSMX-1U-SMDRGB]  158.28,70.44 0 top
Y2  CRYSTAL-GROUNDEDSMD-3.2X2.5  [CRYSTAL-SMD-3.2X2.5MM]  438.65,123.24 180 bottom
Z  KEYSWITCH-RGBSMDLED-ALPSMX-1U-SMDRGB  [ALPSMX-1U-SMDRGB]  77.31,32.34 0 top

## Tracks (layer width: path | path; a pad name or v marks a point on that pad's centre or on a via)
+5V  (via drill 0.35)  (2 unrouted)
  Top 0.406: 465.55,142.01 v465.58,142.04 | v439.92,126.03 440.18,125.78 442.46,125.78 | v443.73,124.26 443.73,124.51 442.46,125.78 | v433.13,144.6 434.08,144.6 | 434.08,144.6 v440.25,144.6 442.18,144.6 443.22,143.56 443.22,142.29 443.81,141.71 445.13,141.71 445.51,141.33 v445.51,139.5 | v445.51,139.5 445.87,139.14 v445.87,135.58 | v445.87,135.58 445.87,135.53 | v445.87,135.58 445.87,129.18 442.46,125.78 | v465.58,142.04 464.13,143.48 | 434.16,144.68 434.08,144.6 | v445.51,139.5 455.67,139.5 458.21,142.04 v465.58,142.04
  Bottom 0.2: J1.A4 463.08,141.86 463.48,141.86 463.64,142.01 J1.B9
  Bottom 0.305: v465.58,142.04 465.55,142.01 J1.B9 | J1.B4 464.74,139.02
  Bottom 0.406: IC3.52 433.08,144.55 | 433.08,144.55 v433.13,144.6 | v440.25,144.6 440.95,143.9 | 440.95,143.9 IC3.62 | 440.95,143.9 440.96,143.89 442.18,143.89 442.56,143.51 | 442.56,143.51 442.56,142.98 IC3.64 | 442.56,143.51 442.67,143.51 444.2,145.04 C3.1 | IC3.21 439.41,127.38 439.41,126.54 v439.92,126.03 | 444.37,139.5 IC3.3 445.5,139.51 v445.51,139.5 | C7.1 447.54,142.8 447.29,142.54 447.29,141.27 v445.52,139.51 | IC3.8 445.88,135.57 446.81,134.65 C5.1 | v443.73,124.26 445.2,124.26 C4.1 R1.1 | C6.1 433.08,145.31 433.08,144.55 | v465.58,142.04 466.08,141.53 466.08,139.47 465.63,139.02 464.74,139.02 464.73,139.01
CC1  (via drill 0.35)
  Top 0.2: v455.16,140.26 447.03,140.26 446.02,141.27 446.02,141.78 445.64,142.16 444.12,142.16 443.68,142.6 443.68,143.75 442.37,145.06 441.73,145.06 441.19,145.59 439.67,145.59 v439.41,145.34
  Bottom 0.2: J1.A5 459.96,141.26 R5.1 456.22,141.31 v455.16,140.26 | IC3.61 440.16,143.8 439.41,144.55 v439.41,145.34
CC2  (via drill 0.35)
  Top 0.2: v469.64,147.62 469.64,144.07 v465.32,139.75
  Bottom 0.2: J1.B5 465.08,139.51 v465.32,139.75 | v469.64,147.62 469.64,149.49 R6.2 469.57,150.48 469.39,150.67 466.85,150.67 466.08,149.91 466.08,146.35 465.83,146.1 462.27,146.1 461.69,145.52 460.03,145.52 457.82,143.31 452.62,143.31 451.86,144.07 449.83,144.07 449.07,144.83 447.29,144.83 445.97,146.15 438.96,146.15 438.65,145.85 438.65,144.58 439.41,143.81 439.41,142.98 IC3.60
COL1  (11 unrouted)
COL2  (11 unrouted)
COL3  (11 unrouted)
COL4  (11 unrouted)
COL5  (9 unrouted)
COL6  (9 unrouted)
COL7  (11 unrouted)
COL8  (9 unrouted)
COL9  (9 unrouted)
COL10  (9 unrouted)
COL12  (11 unrouted)
COL13  (11 unrouted)
COL14  (9 unrouted)
COL15  (5 unrouted)
COL16  (1 unrouted)
COL17  (11 unrouted)
COL18  (7 unrouted)
COL19  (9 unrouted)
COL20  (7 unrouted)
COL21  (11 unrouted)
COL22  (9 unrouted)
COL23  (11 unrouted)
COL24  (7 unrouted)
COL25  (11 unrouted)
D+32U
  Bottom 0.2: IC3.5 445.73,137.93 446.53,138.73 457.82,138.73 R3.2
D+USB
  Bottom 0.152: J1.A6 463.43,140.76 J1.B6
  Bottom 0.2: J1.A6 462.96,140.74 462.04,140.74 460.54,139.24 R3.1
D-32U4
  Bottom 0.2: IC3.4 445.75,138.72 446.27,139.24 456.18,139.24 457.23,140.29 459.08,140.29 459.23,140.15 459.23,138.11 R4.2
D-USB  (via drill 0.35)
  Top 0.152: v461.64,137.87 462.27,138.5 462.27,139.24 462.53,139.5 463.54,139.5 463.8,139.75 464.56,139.75 464.72,139.91 464.72,140.13 v465.3,140.72
  Bottom 0.152: J1.B7 465,141.01 v465.3,140.72
  Bottom 0.2: J1.A7 462.07,140.27 461.64,139.84 v461.64,137.87 v461.64,137.86 460.99,137.21 R4.1
GND  (via drill 0.35)
  Top 0.406: v431.03,137.21 v422.14,137.21 | v438.65,126.29 438.14,125.78 434.84,125.78 434.33,125.27 434.33,121.46 434.84,120.95 v438.91,120.95
  Bottom 0.152: J1.P1_1 463.45,145.06 J1.P1_2
  Bottom 0.254: 439.69,123.98 439.82,124.11 | J1.A1 463.23,143.51 J1.B12 | J1.B1 463.23,137.51 J1.A12
  Bottom 0.305: R6.1 467.6,149.48 | J1.B12 463.81,143.88 | J1.B1 464.18,136.69
  Bottom 0.406: S1.1 463.39,131.73 J1.P2_1 | 442.93,137.15 IC3.6 445.96,137.15 446.78,137.97 449.25,137.97 450.27,136.96 C8.1 C5.2 | 442.93,137.15 438.59,132.8 IC3.22 438.65,127.36 v438.65,126.29 439.19,125.75 439.19,125.73 439.83,125.09 Y2.2 | IC3.63 441.74,141.53 | 441.74,141.53 441.74,138.34 | 441.74,138.34 442.93,137.15 | IC3.53 433.86,142.35 437.87,138.34 441.74,138.34 | 441.74,141.53 443.13,141.53 C3.2 | 463.81,143.88 J1.P1_2 | J1.P4 466.19,145.06 J1.P1_1 460.88,145.06 459.96,144.14 R5.2 459.55,142.8 C7.2 449.38,143.69 448.75,144.32 447.03,144.32 445.86,143.14 C3.2 | J1.P4 467.58,146.51 | 464.18,136.69 J1.P2_2 463.75,136.32 J1.P2_1 | J1.P2_1 464.81,134.54 J1.P5 J1.P4 | R6.1 467.67,146.55 J1.P4 | C3.2 444.98,142.91 | IC3.53 433.86,140.04 v431.03,137.21 | R2.1 v422.14,137.21 | Y2.2 439.9,124.19 C2.2 | C1.2 437.4,122.29 Y2.4 438.89,120.95 v438.91,120.95 443.79,120.95 C4.2 | C6.2 433.22,147.07 433.23,147.07 433.86,146.43 IC3.53 | Y2.2 439.82,124.11
N$1  (2 unrouted)
N$2  (2 unrouted)
N$3  (2 unrouted)
N$4  (2 unrouted)
N$5  (2 unrouted)
N$6  (2 unrouted)
N$7  (2 unrouted)
N$8  (2 unrouted)
N$9  (2 unrouted)
N$10  (2 unrouted)
N$11  (2 unrouted)
N$12  (2 unrouted)
N$13  (2 unrouted)
N$14  (2 unrouted)
N$15  (2 unrouted)
N$16  (2 unrouted)
N$17  (2 unrouted)
N$18  (2 unrouted)
N$19  (2 unrouted)
N$20  (2 unrouted)
N$21  (2 unrouted)
N$22  (2 unrouted)
N$23  (2 unrouted)
N$24  (2 unrouted)
N$25  (2 unrouted)
N$26  (2 unrouted)
N$27  (2 unrouted)
N$28  (2 unrouted)
N$29  (2 unrouted)
N$30  (2 unrouted)
N$31  (2 unrouted)
N$32  (2 unrouted)
N$33  (2 unrouted)
N$34  (2 unrouted)
N$35  (2 unrouted)
N$36  (2 unrouted)
N$37  (2 unrouted)
N$38  (2 unrouted)
N$39  (2 unrouted)
N$40  (2 unrouted)
N$41  (2 unrouted)
N$42  (2 unrouted)
N$43  (2 unrouted)
N$44  (2 unrouted)
N$45  (2 unrouted)
N$46  (2 unrouted)
N$47  (2 unrouted)
N$48  (2 unrouted)
N$49  (2 unrouted)
N$50  (2 unrouted)
N$51  (2 unrouted)
N$52  (2 unrouted)
N$53  (2 unrouted)
N$54  (2 unrouted)
N$55  (2 unrouted)
N$56  (2 unrouted)
N$57  (2 unrouted)
N$58  (2 unrouted)
N$59  (2 unrouted)
N$60  (2 unrouted)
N$61  (2 unrouted)
N$62  (2 unrouted)
N$63  (2 unrouted)
N$64  (2 unrouted)
N$65  (2 unrouted)
N$66  (2 unrouted)
N$67  (2 unrouted)
N$68  (2 unrouted)
N$69  (2 unrouted)
N$70  (2 unrouted)
N$71  (2 unrouted)
N$72  (2 unrouted)
N$73  (2 unrouted)
N$74  (2 unrouted)
N$75  (2 unrouted)
N$76  (2 unrouted)
N$77  (2 unrouted)
N$78  (2 unrouted)
N$79  (2 unrouted)
N$80  (2 unrouted)
N$81  (2 unrouted)
N$82  (2 unrouted)
N$83  (2 unrouted)
N$84  (2 unrouted)
N$85  (2 unrouted)
N$86  (2 unrouted)
N$87  (2 unrouted)
N$88  (2 unrouted)
N$89  (2 unrouted)
N$90  (2 unrouted)
N$91  (2 unrouted)
N$92  (2 unrouted)
N$93  (2 unrouted)
N$94  (2 unrouted)
N$95  (2 unrouted)
N$96  (2 unrouted)
N$97  (2 unrouted)
N$98  (2 unrouted)
N$99  (2 unrouted)
N$100  (2 unrouted)
N$101  (2 unrouted)
N$103  (2 unrouted)
N$104  (2 unrouted)
N$105  (2 unrouted)
N$106  (2 unrouted)
N$107  (1 unrouted)
N$108  (2 unrouted)
N$109  (2 unrouted)
N$110  (2 unrouted)
N$111  (2 unrouted)
N$112  (2 unrouted)
N$113  (2 unrouted)
N$114  (2 unrouted)
N$115  (2 unrouted)
N$118  (1 unrouted)
N$119  (1 unrouted)
N$120  (2 unrouted)
N$121  (1 unrouted)
N$122  (1 unrouted)
N$123  (1 unrouted)
N$124  (1 unrouted)
N$125  (2 unrouted)
N$126  (2 unrouted)
N$127  (2 unrouted)
N$128  (2 unrouted)
N$129  (2 unrouted)
N$130  (2 unrouted)
N$131  (2 unrouted)
N$132  (1 unrouted)
N$133  (1 unrouted)
N$134  (1 unrouted)
N$135  (1 unrouted)
N$136  (1 unrouted)
N$137  (1 unrouted)
N$138  (1 unrouted)
N$139  (1 unrouted)
N$140  (1 unrouted)
N$141  (1 unrouted)
N$142  (1 unrouted)
N$143  (1 unrouted)
N$144  (1 unrouted)
N$145  (1 unrouted)
N$146  (1 unrouted)
N$147  (1 unrouted)
N$149  (1 unrouted)
N$150  (1 unrouted)
N$151  (1 unrouted)
N$152  (1 unrouted)
N$153  (1 unrouted)
N$154  (1 unrouted)
N$155  (1 unrouted)
N$156  (1 unrouted)
N$157  (1 unrouted)
N$158  (1 unrouted)
N$159  (1 unrouted)
N$160  (1 unrouted)
N$161  (1 unrouted)
N$163  (1 unrouted)
N$164  (1 unrouted)
N$165  (1 unrouted)
N$166  (1 unrouted)
N$167  (1 unrouted)
N$168  (1 unrouted)
N$169  (1 unrouted)
N$170  (1 unrouted)
N$171  (1 unrouted)
N$172  (1 unrouted)
N$173  (1 unrouted)
N$174  (1 unrouted)
N$175  (1 unrouted)
N$176  (1 unrouted)
N$177  (1 unrouted)
N$178  (1 unrouted)
N$179  (1 unrouted)
N$180  (1 unrouted)
N$181  (1 unrouted)
N$182  (1 unrouted)
N$183  (1 unrouted)
N$184  (1 unrouted)
N$185  (1 unrouted)
N$187  (1 unrouted)
N$188  (1 unrouted)
N$189  (1 unrouted)
N$190  (1 unrouted)
N$191  (1 unrouted)
N$192  (1 unrouted)
N$193  (1 unrouted)
N$194  (1 unrouted)
N$195  (1 unrouted)
N$196  (1 unrouted)
N$197  (1 unrouted)
N$198  (1 unrouted)
N$199  (1 unrouted)
N$200  (1 unrouted)
N$201  (1 unrouted)
N$202  (1 unrouted)
N$203  (1 unrouted)
N$204  (1 unrouted)
N$205  (1 unrouted)
N$206  (1 unrouted)
N$207  (1 unrouted)
N$208  (1 unrouted)
N$209  (1 unrouted)
N$210  (1 unrouted)
N$211  (1 unrouted)
N$212  (1 unrouted)
N$214  (1 unrouted)
N$215  (1 unrouted)
N$216  (1 unrouted)
N$217  (1 unrouted)
N$218  (1 unrouted)
N$219  (1 unrouted)
N$220  (1 unrouted)
N$221  (1 unrouted)
N$222  (1 unrouted)
N$223  (1 unrouted)
N$224  (1 unrouted)
N$225  (1 unrouted)
N$227  (1 unrouted)
N$228  (1 unrouted)
N$229  (1 unrouted)
N$230  (1 unrouted)
N$232  (1 unrouted)
N$233  (1 unrouted)
N$234  (1 unrouted)
N$235  (1 unrouted)
N$238  (1 unrouted)
N$242  (1 unrouted)
N$243  (1 unrouted)
N$245  (1 unrouted)
N$246  (1 unrouted)
N$248  (1 unrouted)
N$249  (1 unrouted)
N$250  (1 unrouted)
N$251  (1 unrouted)
PE2
  Bottom 0.2: R2.2 428.8,137.21 IC3.43
RESET
  Bottom 0.2: IC3.20 440.18,127.41 440.18,126.67 441.07,125.78 447.58,125.78 | 447.58,125.78 448.57,124.79 448.57,123.79 447.26,122.48 R1.2 | S1.2 463.29,127.3 459.88,127.3 458.35,125.78 447.58,125.78
ROW1  (23 unrouted)
ROW2  (22 unrouted)
ROW3  (22 unrouted)
ROW4  (17 unrouted)
ROW5  (18 unrouted)
ROW6  (13 unrouted)
UCAP
  Bottom 0.2: IC3.7 445.93,136.36 446.27,136.7 C8.2
XTAL1
  Bottom 0.2: C1.1 437.4,124.19 | 437.4,124.19 Y2.1 | 437.4,124.19 437.48,124.27 437.48,125.2 437.01,125.67 IC3.24
XTAL2
  Bottom 0.2: IC3.23 437.8,126.12 438.91,125.02 438.91,123.24 439.78,122.37 Y2.3 441.63,122.37 C2.1 441.78,122.37